# EAGLE schematic test_pico (EAGLE 9.6.2)
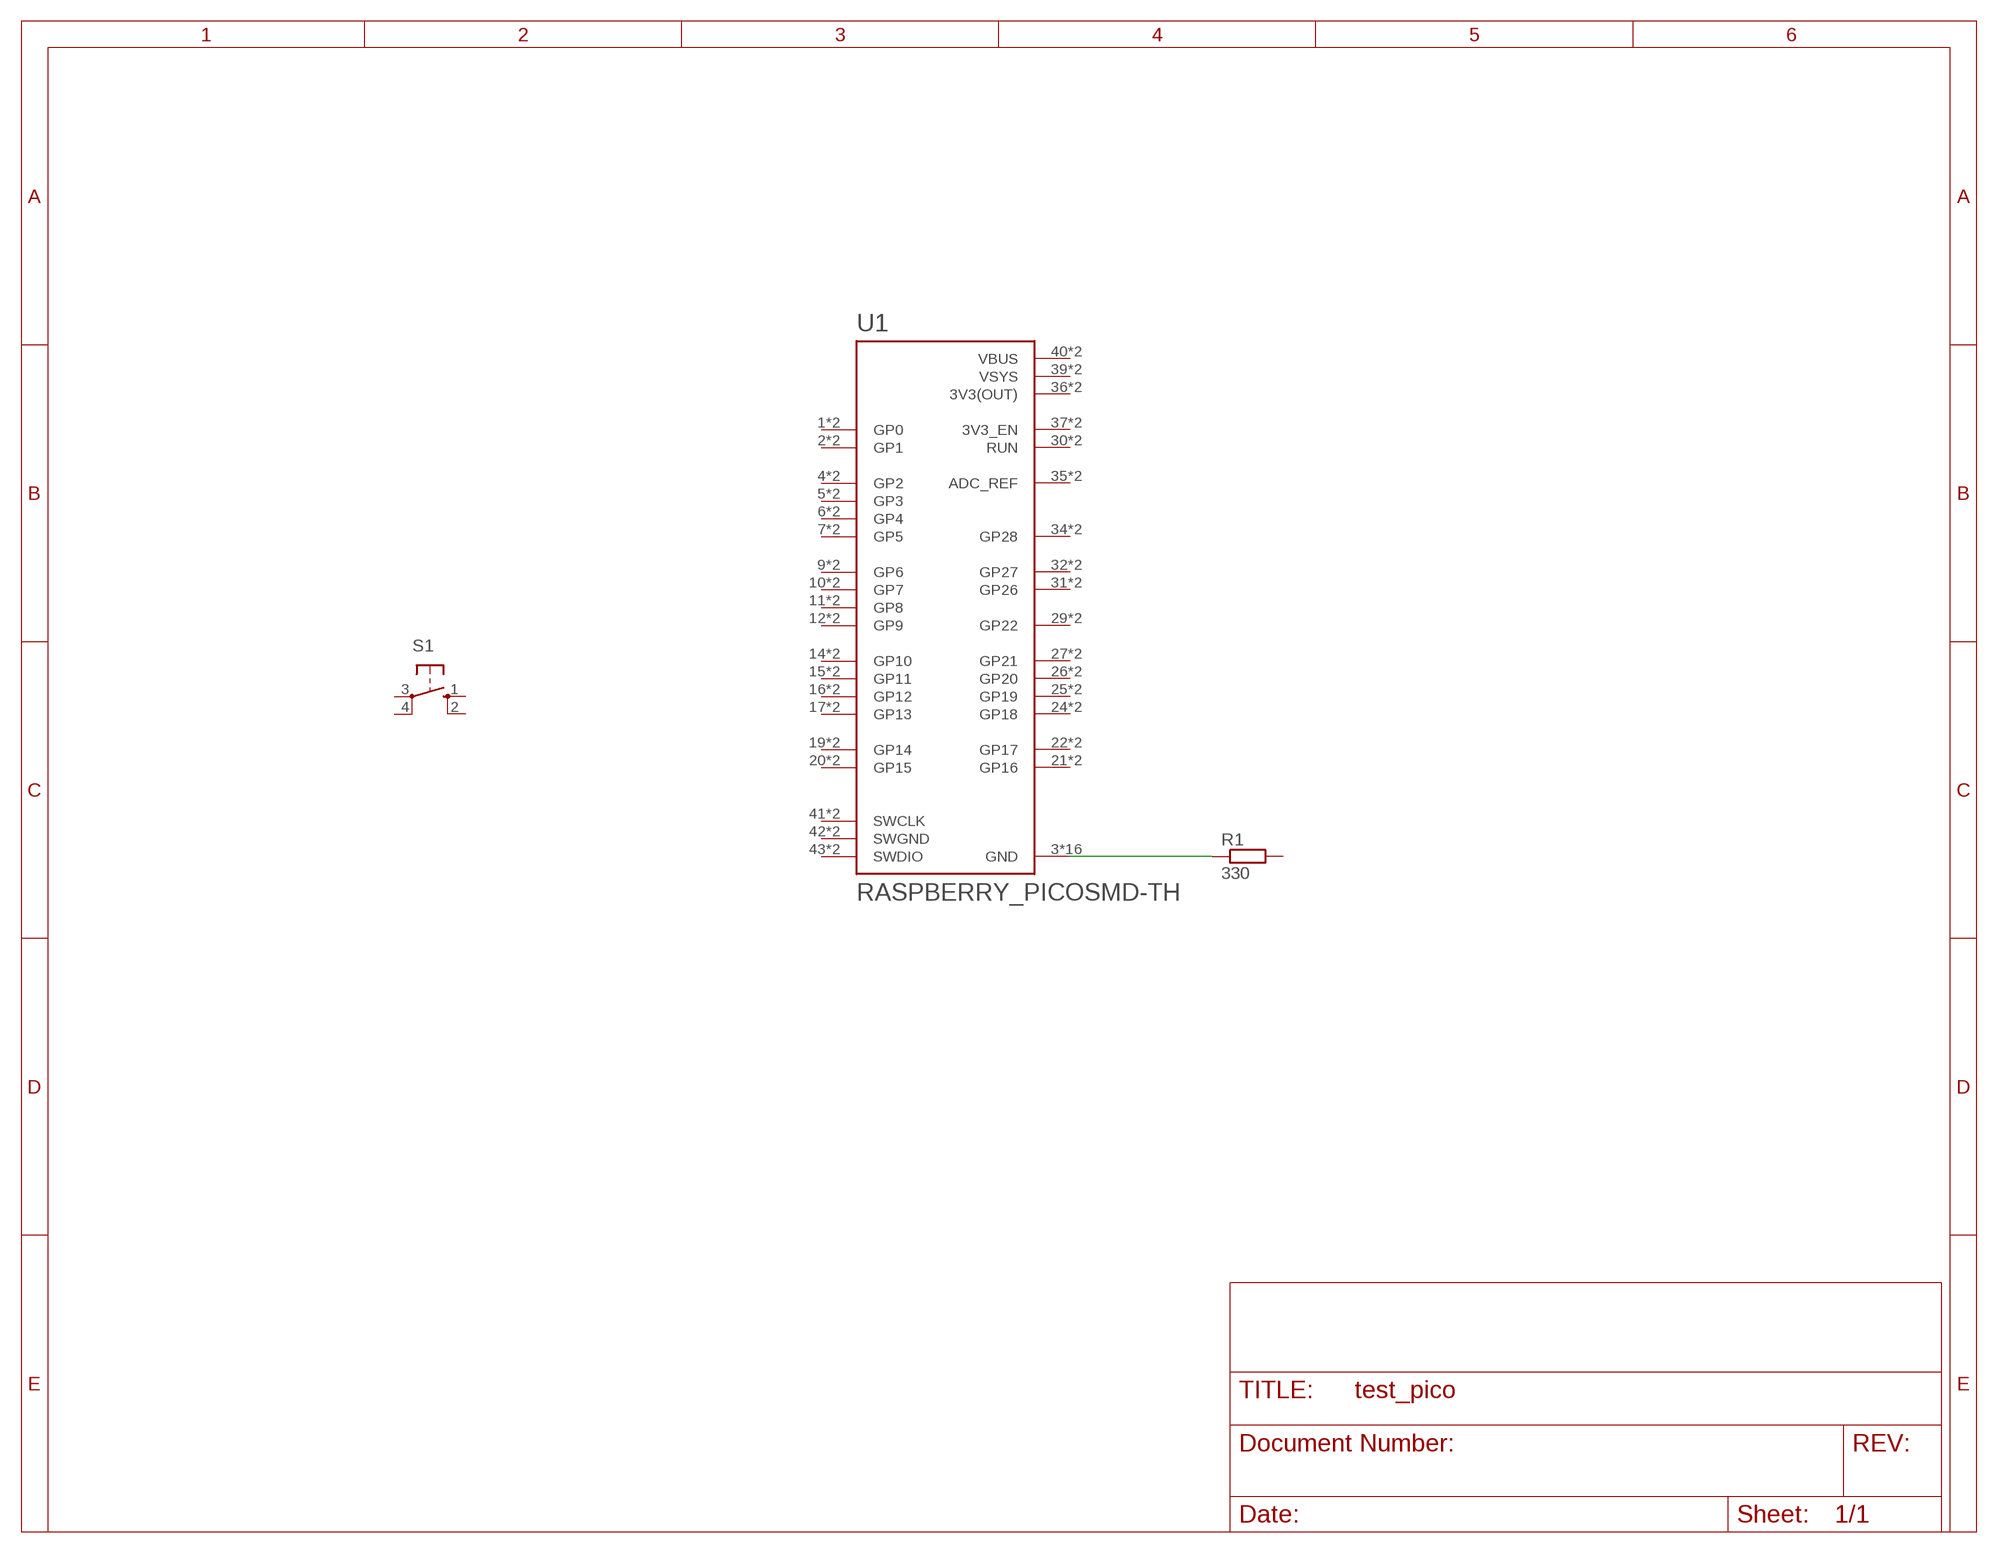
[diagram p0: schematic, sheet 1]

## Parts
R1  330  R-EU_0207/12  [0207/12]
S1  10-XX  [B3F-10XX]
U1  RASPBERRY_PICOSMD-TH  [PICO-PKG]

## Nets
N$1: R1.1 U1.3(GND) U1.8(GND) U1.13(GND) U1.18(GND) U1.23(GND) U1.28(GND) U1.33(GND) U1.38(GND) U1.P$3(GND) U1.P$8(GND) U1.P$13(GND) U1.P$18(GND) U1.P$23(GND) U1.P$28(GND) U1.P$33(GND) U1.P$38(GND)
Unconnected: R1.2 S1.1(S) S1.2(S1) S1.3(P) S1.4(P1) U1.1(GP0) U1.2(GP1) U1.4(GP2) U1.5(GP3) U1.6(GP4) U1.7(GP5) U1.9(GP6) U1.10(GP7) U1.11(GP8) U1.12(GP9) U1.14(GP10) U1.15(GP11) U1.16(GP12) U1.17(GP13) U1.19(GP14) U1.20(GP15) U1.21(GP16) U1.22(GP17) U1.24(GP18) U1.25(GP19) U1.26(GP20) U1.27(GP21) U1.29(GP22) U1.30(RUN) U1.31(GP26) U1.32(GP27) U1.34(GP28) U1.35(ADC_REF) U1.37(3V3_EN) U1.41(SWCLK) U1.43(SWDIO) U1.P$1(GP0) U1.P$2(GP1) U1.P$4(GP2) U1.P$5(GP3) U1.P$6(GP4) U1.P$7(GP5) U1.P$9(GP6) U1.P$10(GP7) U1.P$11(GP8) U1.P$12(GP9) U1.P$14(GP10) U1.P$15(GP11) U1.P$16(GP12) U1.P$17(GP13) U1.P$19(GP14) U1.P$20(GP15) U1.P$21(GP16) U1.P$22(GP17) U1.P$24(GP18) U1.P$25(GP19) U1.P$26(GP20) U1.P$27(GP21) U1.P$29(GP22) U1.P$30(RUN) U1.P$31(GP26) U1.P$32(GP27) U1.P$34(GP28) U1.P$35(ADC_REF) U1.P$37(3V3_EN) U1.P$41(SWCLK) U1.P$43(SWDIO)

## Power pins joined to a net without a drawn wire
3V3(OUT): U1.36(3V3(OUT)) U1.P$36(3V3(OUT))
SWGND: U1.42(SWGND) U1.P$42(SWGND)
VBUS: U1.40(VBUS) U1.P$40(VBUS)
VSYS: U1.39(VSYS) U1.P$39(VSYS)

## Library data of the parts
R1 = rcl:R-EU_: RESISTOR, European symbol; SPICEPREFIX: R
S1 = switch-omron:10-XX: OMRON SWITCH; MPN: B3F-1000; OC_FARNELL: 176432; OC_NEWARK: 36M3542
U1 = RpiPico:RASPBERRY_PICO: Raspberry Pi Pico